# Altium project AirProbe1.PrjPCB
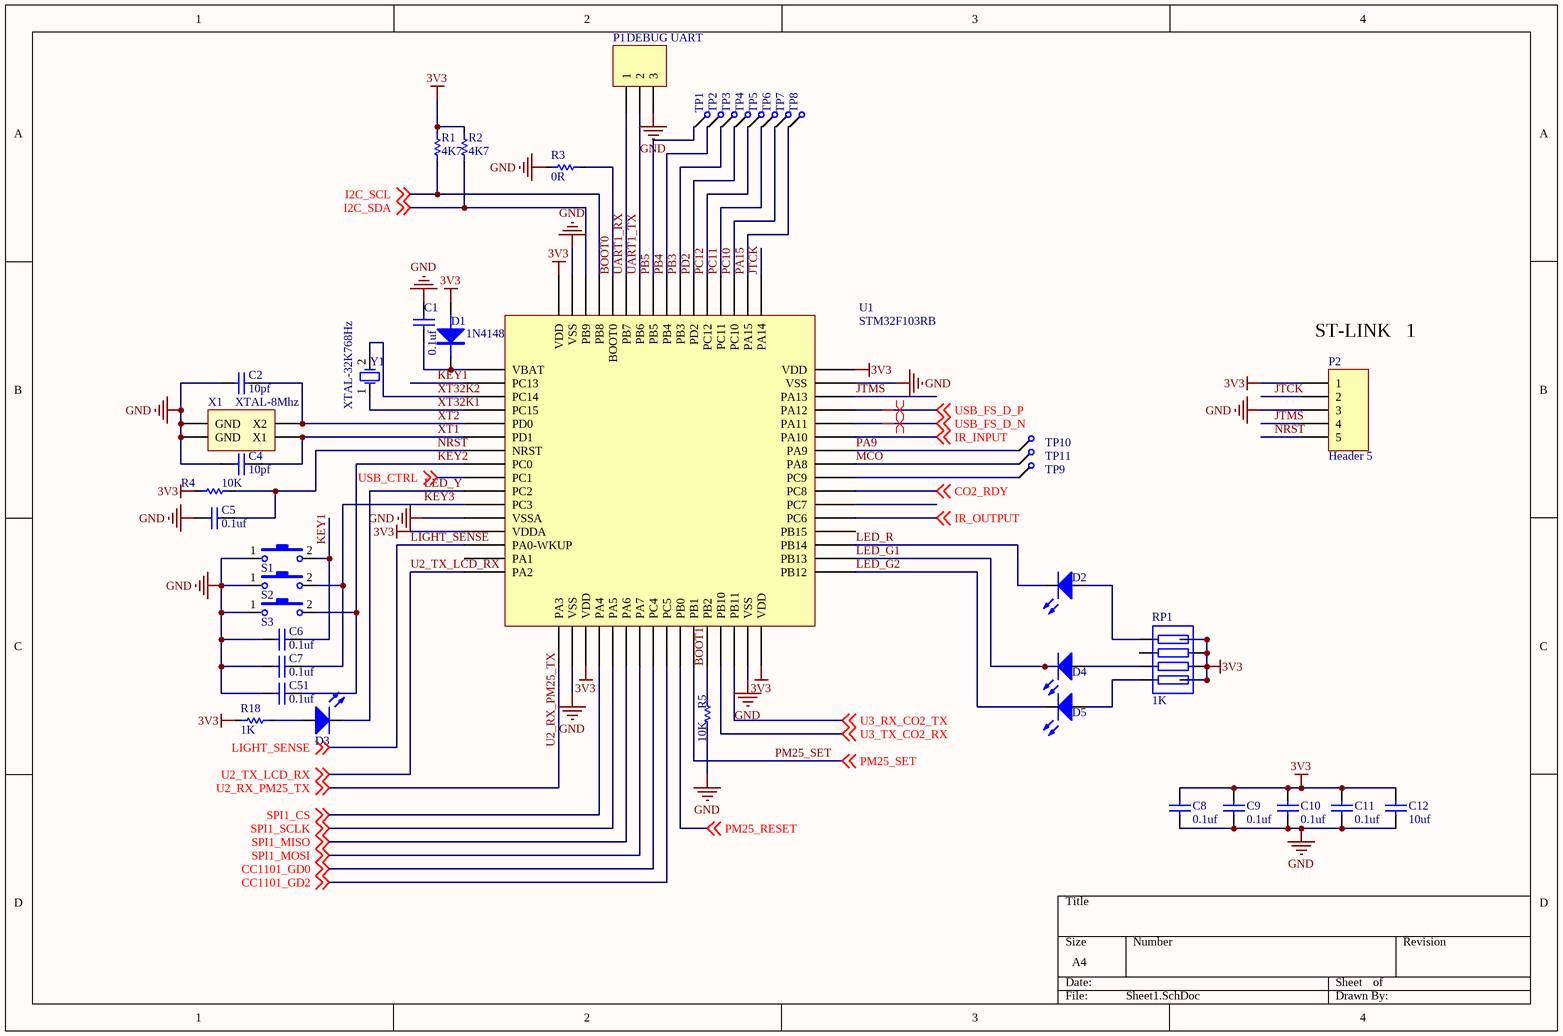
[diagram p0: Sheet1.SchDoc]
4 sheets, 124 parts. Net scope: global (net labels, ports and power ports of the same name join across sheets).
Board file: PCB.PcbDoc
Sheets:
  Sheet1.SchDoc
  Sheet2.SchDoc
  Sheet3.SchDoc
  Sheet4.SchDoc

## Sheet Sheet1.SchDoc
size A4

### Parts
C1  0.1uf  [C0603]
C2  10pf  [C0603]
C4  10pf  [C0603]
C5  0.1uf  [C0603]
C6  0.1uf  [C0603]
C7  0.1uf  [C0603]
C8  0.1uf  [C0603]
C9  0.1uf  [C0603]
C10  0.1uf  [C0603]
C11  0.1uf  [C0603]
C12  10uf  [C1206]
C51  0.1uf  [C0603]
D1  1N4148  [D0805]
D2  红色LED  [LED0603]  (value not drawn)
D3  黄色LED  [LED0603]  (value not drawn)
D4  红色LED  [LED0603]  (value not drawn)
D5  红色LED  [LED0603]  (value not drawn)
P1  DEBUG UART  [HDR1X3]
P2  Header 5  [HDR1X5]
R1  4K7  [R0603]
R2  4K7  [R0603]
R3  0R  [R0603]
R4  10K  [R0603]
R5  10K  [R0603]
R18  1K  [R0603]
RP1  1K  [R_PACK4_SMD]
S1  SW-PB  [SWPB_SMD_90D_48_18_15]  (value not drawn)
S2  SW-PB  [SWPB_SMD_90D_48_18_15]  (value not drawn)
S3  SW-PB  [SW2*1Small]  (value not drawn)
TP1  TestPoint  [TP_0.8]  (value not drawn)
TP2  TestPoint  [TP_0.8]  (value not drawn)
TP3  TestPoint  [TP_0.8]  (value not drawn)
TP4  TestPoint  [TP_0.8]  (value not drawn)
TP5  TestPoint  [TP_0.8]  (value not drawn)
TP6  TestPoint  [TP_0.8]  (value not drawn)
TP7  TestPoint  [TP_0.8]  (value not drawn)
TP8  TestPoint  [TP_0.8]  (value not drawn)
TP9  TestPoint  [TP_0.8]  (value not drawn)
TP10  TestPoint  [TP_0.8]  (value not drawn)
TP11  TestPoint  [TP_0.8]  (value not drawn)
U1  STM32F103RB  [STM32F103RB]
X1  XTAL-8Mhz  [XTAL5032]
Y1  XTAL-32K768Hz  [CRY_S]

### Nets
3V3: C8.2 C9.2 C10.2 C11.2 C12.2 D1.1(A) P2.1 R1.2 R2.2 R4.2 R18.1 RP1.1 RP1.3 RP1.5 RP1.7 U1.13(VDDA) U1.19(VDD) U1.32(VDD) U1.48(VDD) U1.64(VDD)
GND: C1.2 C2.1 C4.2 C5.2 C6.2 C7.2 C8.1 C9.1 C10.1 C11.1 C12.1 C51.1 P1.3 P2.3 R3.1 R5.1 S1.1 S2.1 S3.1 U1.12(VSSA) U1.18(VSS) U1.31(VSS) U1.47(VSS) U1.63(VSS) X1.2(GND) X1.4(GND)
BOOT0: R3.2 U1.60(BOOT0)
BOOT1: R5.2 U1.28(PB2)
CC1101_GD0: U1.24(PC4) ; off-sheet CC1101_GD0
CC1101_GD2: U1.25(PC5) ; off-sheet CC1101_GD2
CO2_RDY: U1.39(PC8) ; off-sheet CO2_RDY
I2C_SCL: R1.1 U1.61(PB8) ; off-sheet I2C_SCL
I2C_SDA: R2.1 U1.62(PB9) ; off-sheet I2C_SDA
IR_INPUT: U1.43(PA10) ; off-sheet IR_INPUT
IR_OUTPUT: U1.37(PC6) ; off-sheet IR_OUTPUT
JTCK: P2.2 U1.49(PA14)
JTMS: P2.4 U1.46(PA13)
KEY1: C6.1 S1.2 U1.2(PC13)
KEY2: C51.2 S3.2 U1.8(PC0)
KEY3: C7.1 S2.2 U1.11(PC3)
LED_G1: D4.2(K) U1.34(PB13)
LED_G2: D5.2(K) U1.33(PB12)
LED_R: D2.2(K) U1.35(PB14)
LED_Y: D3.2(K) U1.10(PC2)
LIGHT_SENSE: U1.14(PA0-WKUP) ; off-sheet LIGHT_SENSE
MCO: TP11.1 U1.41(PA8)
NRST: C5.1 P2.5 R4.1 U1.7(NRST)
PA9: TP10.1 U1.42(PA9)
PA15: TP8.1 U1.50(PA15)
PB3: TP3.1 U1.55(PB3)
PB4: TP2.1 U1.56(PB4)
PB5: TP1.1 U1.57(PB5)
PC10: TP7.1 U1.51(PC10)
PC11: TP6.1 U1.52(PC11)
PC12: TP5.1 U1.53(PC12)
PD2: TP4.1 U1.54(PD2)
PM25_RESET: U1.26(PB0) ; off-sheet PM25_RESET
PM25_SET: U1.27(PB1) ; off-sheet PM25_SET
SPI1_CS: U1.20(PA4) ; off-sheet SPI1_CS
SPI1_MISO: U1.22(PA6) ; off-sheet SPI1_MISO
SPI1_MOSI: U1.23(PA7) ; off-sheet SPI1_MOSI
SPI1_SCLK: U1.21(PA5) ; off-sheet SPI1_SCLK
U2_RX_PM25_TX: U1.17(PA3) ; off-sheet U2_RX_PM25_TX
U2_TX_LCD_RX: U1.16(PA2) ; off-sheet U2_TX_LCD_RX
U3_RX_CO2_TX: U1.30(PB11) ; off-sheet U3_RX_CO2_TX
U3_TX_CO2_RX: U1.29(PB10) ; off-sheet U3_TX_CO2_RX
UART1_RX: P1.1 U1.59(PB7)
UART1_TX: P1.2 U1.58(PB6)
USB_CTRL: U1.9(PC1) ; off-sheet USB_CTRL
USB_FS_D_N: U1.44(PA11) ; off-sheet USB_FS_D_N
USB_FS_D_P: U1.45(PA12) ; off-sheet USB_FS_D_P
XT1: C4.1 U1.6(PD1) X1.1(X1)
XT2: C2.2 U1.5(PD0) X1.3(X2)
XT32K1: U1.4(PC15) Y1.1(OSC1)
XT32K2: U1.3(PC14) Y1.2(OSC2)
NetC1_1: C1.1 D1.2(K) U1.1(VBAT)
NetD2_1: D2.1(A) RP1.8
NetD3_1: D3.1(A) R18.2
NetD4_1: D4.1(A) RP1.4
NetD5_1: D5.1(A) RP1.2
NetTP9_1: TP9.1 U1.40(PC9)

Not connected (* = marked no-connect by the designer): RP1 6; U1 15(PA1) 36(PB15) 38(PC7)

### Layout directives
differential pair: USB_FS_D_N, USB_FS_D_P

### Notes on the sheet
- (near P2) ST-LINK   1

### Library data of the parts
C1 C5-C12 C51 = Cap: Capacitor; Option: 25V  X7R
  C1 C5-C11 C51: Value: 0.1uf
  C12: Value: 10uf
C2 C4 = Cap: Capacitor; Published: 8-Jun-2000; LatestRevisionDate: 17-Jul-2002; LatestRevisionNote: Re-released for DXP Platform.; PackageReference: RAD-0.3; Publisher: Altium Limited; Value: 10pf
D1 = DIODE: Value: 1N4148
D2-D5 = LED: Typical INFRARED GaAs LED; Published: 8-Jun-2000; LatestRevisionDate: 08-Jul-2005; LatestRevisionNote: Mech Layer 1 removed.; PackageReference: LED-0; Publisher: Altium Limited
  D2 D4 D5: Color: 红色LED
  D3: Color: 黄色LED
P1 = Header 3: Header, 3-Pin; LatestRevisionDate: 17-Jul-2002; LatestRevisionNote: Re-released for DXP Platform.; Publisher: Altium Limited
P2 = Header 5: Header, 5-Pin; LatestRevisionDate: 17-Jul-2002; LatestRevisionNote: Re-released for DXP Platform.; Publisher: Altium Limited
R1-R5 R18 = Res: Published: 8-Jun-2000; LatestRevisionDate: 17-Jul-2002; LatestRevisionNote: Re-released for DXP Platform.; PackageReference: AXIAL-0.3; Publisher: Altium Limited
  R1 R2: Value: 4K7
  R3: Value: 0R
  R4 R5: Value: 10K
  R18: Value: 1K
RP1 = RESPACK4: Value: 1K
S1-S3 = SW-PB: Switch; Published: 24-Mar-1999; LatestRevisionDate: 17-Jul-2002; LatestRevisionNote: Re-released for DXP Platform.; PackageReference: SPST-2; Publisher: Altium Limited
TP1-TP11 = TestPoint: 一个测试点
X1 = XTALSMT
Y1 = XTAL: Crystal Oscillator 32K; Published: 8-Jun-2000; LatestRevisionDate: 17-Jul-2002; LatestRevisionNote: Re-released for DXP Platform.; PackageReference: R38; Publisher: Altium Limited

## Sheet Sheet2.SchDoc
size A4
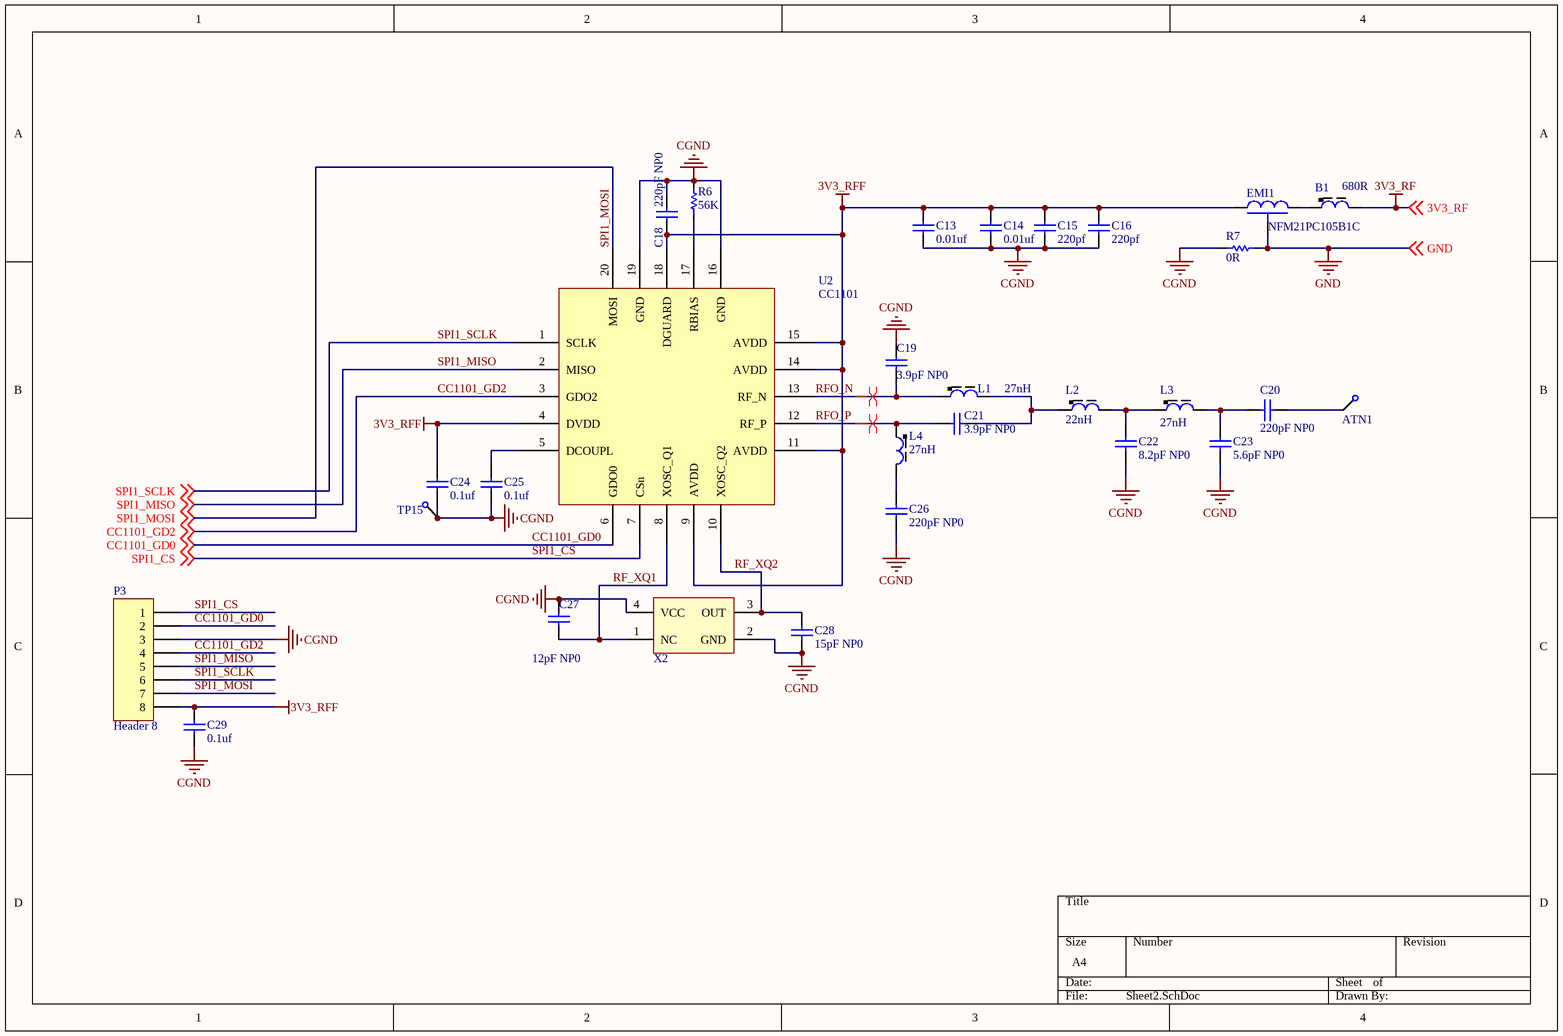
[diagram p1: Sheet2.SchDoc]

### Parts
ATN1  TestPoint  [TP]  (value not drawn)
B1  680R  [L0603]
C13  0.01uf  [C0603]
C14  0.01uf  [C0603]
C15  220pf  [C0603]
C16  220pf  [C0603]
C18  220pF NP0  [C0603]
C19  3.9pF NP0  [C0603]
C20  220pF NP0  [C0603]
C21  3.9pF NP0  [C0603]
C22  8.2pF NP0  [C0603]
C23  5.6pF NP0  [C0603]
C24  0.1uf  [C0603]
C25  0.1uf  [C0603]
C26  220pF NP0  [C0603]
C27  12pF NP0  [C0603]
C28  15pF NP0  [C0603]
C29  0.1uf  [C0603]
EMI1  NFM21PC105B1C  [NFM21PC]
L1  27nH  [L0603]
L2  22nH  [L0603]
L3  27nH  [L0603]
L4  27nH  [L0603]
P3  Header 8  [CC1101]
R6  56K  [R0603]
R7  0R  [R0603]
TP15  TestPoint  [TP_0.8]  (value not drawn)
U2  CC1101  [QFN50P400X400X80_HS-21N]
X2  XTAL4  [XTAL3225]  (value not drawn)

### Nets
3V3_RF: B1.2 ; off-sheet 3V3_RF
3V3_RFF: C13.2 C14.2 C15.2 C16.2 C18.1 C24.2 C29.2 EMI1.1 P3.8 U2.4(DVDD) U2.9(AVDD) U2.11(AVDD) U2.14(AVDD) U2.15(AVDD) U2.18(DGUARD)
CGND: C13.1 C14.1 C15.1 C16.1 C18.2 C19.2 C22.1 C23.1 C24.1 C25.1 C26.1 C27.2 C28.1 C29.1 P3.3 R6.2 R7.1 TP15.1 U2.16(GND) U2.19(GND) X2.2(GND) X2.4(VCC)
GND: EMI1.2 R7.2 ; off-sheet GND
CC1101_GD0: P3.2 U2.6(GDO0) ; off-sheet CC1101_GD0
CC1101_GD2: P3.4 U2.3(GDO2) ; off-sheet CC1101_GD2
RF_XQ1: C27.1 U2.8(XOSC_Q1) X2.1(NC)
RF_XQ2: C28.2 U2.10(XOSC_Q2) X2.3(OUT)
RFO_N: C19.1 L1.1 U2.13(RF_N)
RFO_P: C21.2 L4.1 U2.12(RF_P)
SPI1_CS: P3.1 U2.7(CSn) ; off-sheet SPI1_CS
SPI1_MISO: P3.5 U2.2(MISO) ; off-sheet SPI1_MISO
SPI1_MOSI: P3.7 U2.20(MOSI) ; off-sheet SPI1_MOSI
SPI1_SCLK: P3.6 U2.1(SCLK) ; off-sheet SPI1_SCLK
NetATN1_1: ATN1.1 C20.1
NetB1_1: B1.1 EMI1.3
NetC20_2: C20.2 C23.2 L3.2
NetC21_1: C21.1 L1.2 L2.1
NetC22_2: C22.2 L2.2 L3.1
NetC25_2: C25.2 U2.5(DCOUPL)
NetC26_2: C26.2 L4.2
NetR6_1: R6.1 U2.17(RBIAS)

### Layout directives
differential pair: RFO_N, RFO_P

### Library data of the parts
ATN1 TP15 = TestPoint: 一个测试点
B1 L2 = L
  B1: Value: 680R
  L2: Value: 22nH
C13-C16 C18-C29 = Cap: Capacitor; Option: 25V  X7R
  C13 C14: Value: 0.01uf
  C15 C16: Value: 220pf
  C18 C20 C26: Value: 220pF NP0
  C19 C21: Value: 3.9pF NP0
  C22: Value: 8.2pF NP0
  C23: Value: 5.6pF NP0
  C24 C25 C29: Value: 0.1uf
  C27: Value: 12pF NP0
  C28: Value: 15pF NP0
L1 L3 L4 = L: LQG15HS27NJ02D; Value: 27nH
P3 = Header 8: Header, 8-Pin; LatestRevisionDate: 17-Jul-2002; LatestRevisionNote: Re-released for DXP Platform.; Publisher: Altium Limited
R6 R7 = Res: Published: 8-Jun-2000; LatestRevisionDate: 17-Jul-2002; LatestRevisionNote: Re-released for DXP Platform.; PackageReference: AXIAL-0.3; Publisher: Altium Limited
  R6: Value: 56K
  R7: Value: 0R

## Sheet Sheet3.SchDoc
size A4
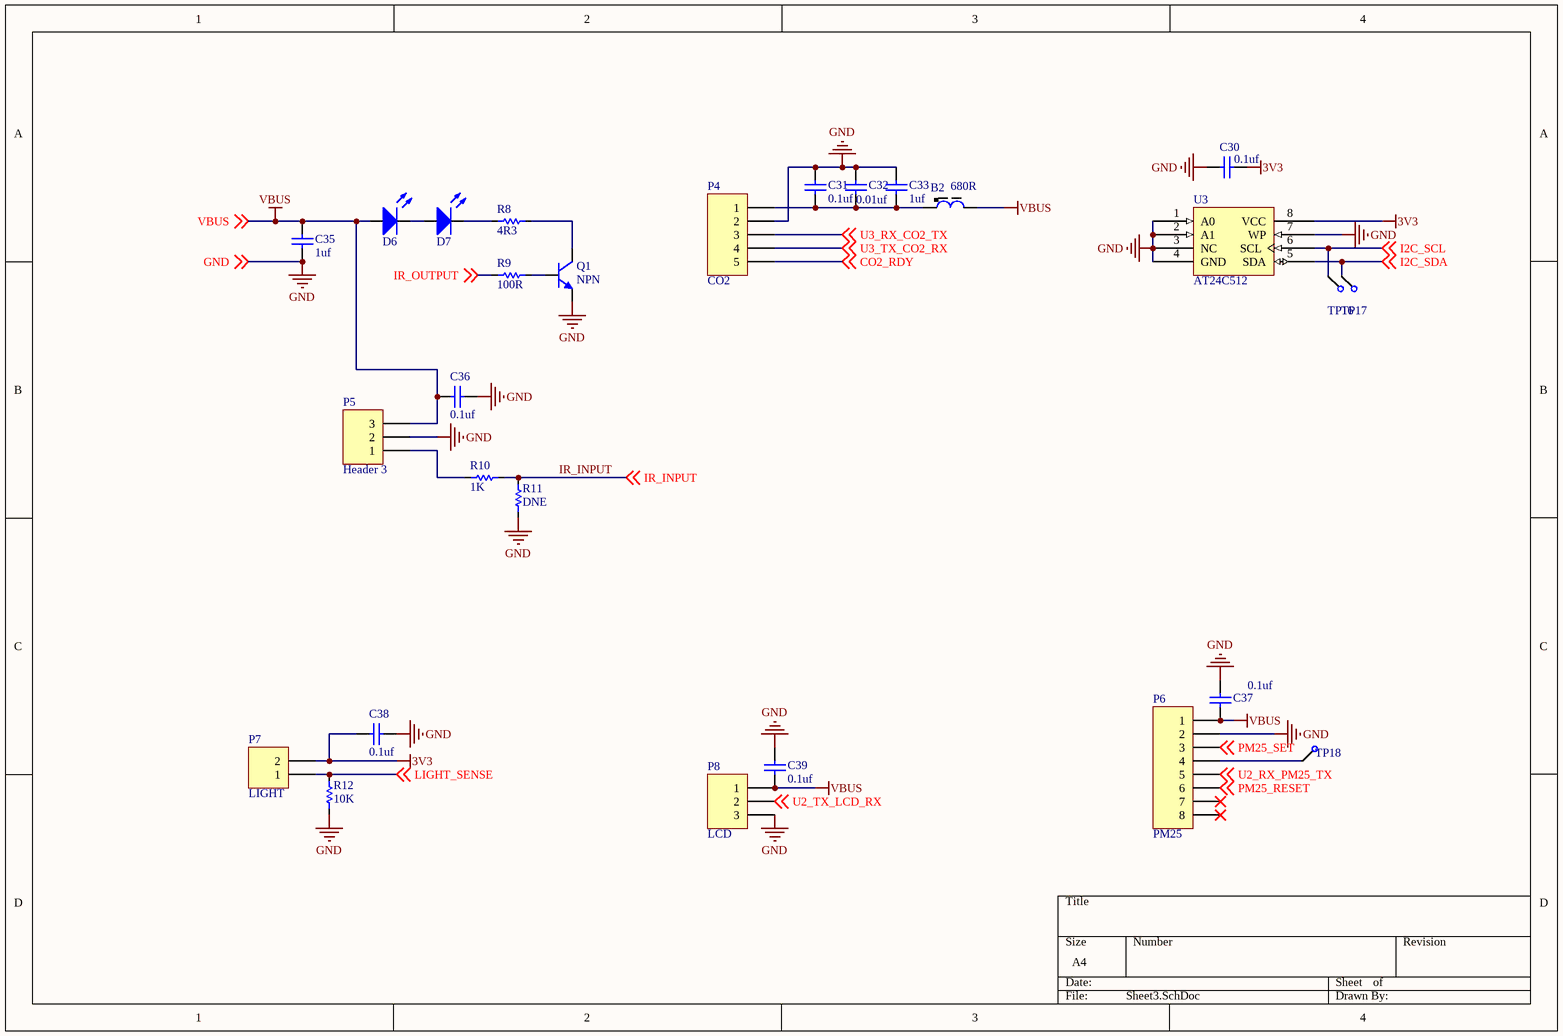
[diagram p2: Sheet3.SchDoc]

### Parts
B2  680R  [L0603]
C30  0.1uf  [C0603]
C31  0.1uf  [C0603]
C32  0.01uf  [C0603]
C33  1uf  [C0603]
C35  1uf  [C0603]
C36  0.1uf  [C0603]
C37  0.1uf  [C0603]
C38  0.1uf  [C0603]
C39  0.1uf  [C0603]
D6  LED-R  [LED_S]  (value not drawn)
D7  LED-R  [LED_S]  (value not drawn)
P4  CO2  [HDR1X5]
P5  Header 3  [HDR1X3]
P6  PM25  [1.25T-8P]
P7  LIGHT  [HDR1X2]
P8  LCD  [HDR1X3]
Q1  NPN  [SOT23_BJT]
R8  4R3  [R0805]
R9  100R  [R0603]
R10  1K  [R0603]
R11  DNE  [R0603]
R12  10K  [R0603]
TP16  TestPoint  [TP_0.8]  (value not drawn)
TP17  TestPoint  [TP_0.8]  (value not drawn)
TP18  TestPoint  [TP_0.8]  (value not drawn)
U3  AT24C512  [AT24C02]

### Nets
3V3: C30.2 C38.2 P7.2 U3.8(VCC)
GND: C30.1 C31.2 C32.2 C33.2 C35.1 C36.1 C37.2 C38.1 C39.2 P4.2 P5.2 P6.2 P8.3 Q1.1(E) R11.1 R12.1 U3.1(A0) U3.2(A1) U3.3(NC) U3.4(GND) U3.7(WP) ; off-sheet GND
VBUS: B2.2 C35.2 C36.2 C37.1 C39.1 D6.1(A) P5.3 P6.1 P8.1 ; off-sheet VBUS
CO2_RDY: P4.5 ; off-sheet CO2_RDY
I2C_SCL: TP16.1 U3.6(SCL) ; off-sheet I2C_SCL
I2C_SDA: TP17.1 U3.5(SDA) ; off-sheet I2C_SDA
IR_INPUT: R10.2 R11.2 ; off-sheet IR_INPUT
IR_OUTPUT: R9.1 ; off-sheet IR_OUTPUT
LIGHT_SENSE: P7.1 R12.2 ; off-sheet LIGHT_SENSE
PM25_RESET: P6.6 ; off-sheet PM25_RESET
PM25_SET: P6.3 ; off-sheet PM25_SET
U2_RX_PM25_TX: P6.5 ; off-sheet U2_RX_PM25_TX
U2_TX_LCD_RX: P8.2 ; off-sheet U2_TX_LCD_RX
U3_RX_CO2_TX: P4.3 ; off-sheet U3_RX_CO2_TX
U3_TX_CO2_RX: P4.4 ; off-sheet U3_TX_CO2_RX
NetB2_1: B2.1 C31.1 C32.1 C33.1 P4.1
NetD6_2: D6.2(K) D7.1(A)
NetD7_2: D7.2(K) R8.2
NetP5_1: P5.1 R10.1
NetP6_4: P6.4 TP18.1
NetQ1_2: Q1.2(B) R9.2
NetQ1_3: Q1.3(C) R8.1

Not connected (* = marked no-connect by the designer): P6 7* 8*

### Library data of the parts
B2 = L: Value: 680R
C30-C33 C35-C39 = Cap: Capacitor; Option: 25V  X7R
  C30 C31 C36-C39: Value: 0.1uf
  C32: Value: 0.01uf
  C33 C35: Value: 1uf
D6 D7 = LED: Typical INFRARED GaAs LED; Published: 8-Jun-2000; LatestRevisionDate: 08-Jul-2005; LatestRevisionNote: Mech Layer 1 removed.; PackageReference: LED-0; Publisher: Altium Limited; Color: LED-R
P4 = Header 5: Header, 5-Pin; LatestRevisionDate: 17-Jul-2002; LatestRevisionNote: Re-released for DXP Platform.; Publisher: Altium Limited
P5 P8 = Header 3: Header, 3-Pin; LatestRevisionDate: 17-Jul-2002; LatestRevisionNote: Re-released for DXP Platform.; Publisher: Altium Limited
P6 = Header 8: Header, 8-Pin; LatestRevisionDate: 17-Jul-2002; LatestRevisionNote: Re-released for DXP Platform.; Publisher: Altium Limited
P7 = Header 2: Header, 2-Pin; LatestRevisionDate: 17-Jul-2002; LatestRevisionNote: Re-released for DXP Platform.; Publisher: Altium Limited
Q1 = NPN: NPN Bipolar Transistor; Published: 8-Jun-2000; LatestRevisionDate: 17-Jul-2002; LatestRevisionNote: Re-released for DXP Platform.; PackageReference: TO-226; Publisher: Altium Limited; Code_JEDEC: TO-226-AA
R8-R12 = Res: Published: 8-Jun-2000; LatestRevisionDate: 17-Jul-2002; LatestRevisionNote: Re-released for DXP Platform.; PackageReference: AXIAL-0.3; Publisher: Altium Limited
  R8: Value: 4R3
  R9: Value: 100R
  R10: Value: 1K
  R11: Value: DNE
  R12: Value: 10K
TP16-TP18 = TestPoint: 一个测试点
U3 = AT24C512: 2-wire Serial  EEPROM  512K (65,536 x 8)

## Sheet Sheet4.SchDoc
size A4
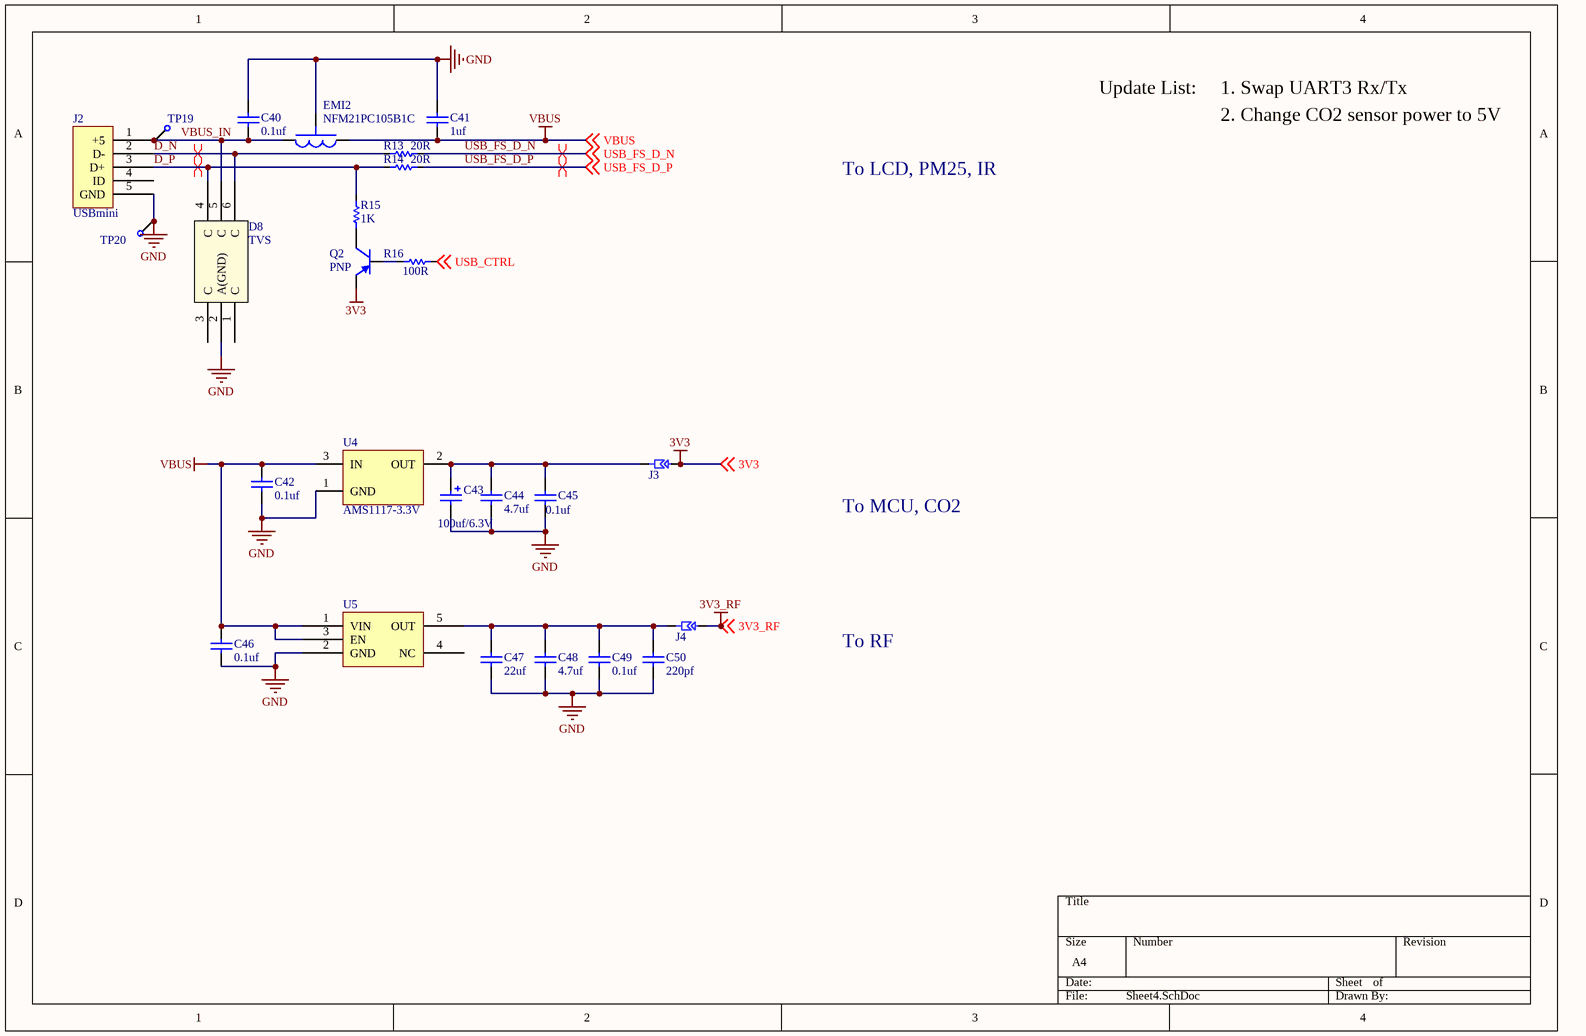
[diagram p3: Sheet4.SchDoc]

### Parts
C40  0.1uf  [C0603]
C41  1uf  [C0603]
C42  0.1uf  [C0603]
C43  value 100uf/6.3V  [C_B型]  (hidden comment: 25V)
C44  4.7uf  [C0805]
C45  0.1uf  [C0603]
C46  0.1uf  [C0603]
C47  22uf  [C1206]
C48  4.7uf  [C0603]
C49  0.1uf  [C0603]
C50  220pf  [C0603]
D8  TVS  [USBLC6-2]
EMI2  NFM21PC105B1C  [NFM21PC]
J2  USBmini  [USB_MICRO_B]
J3  JUMPER  [Jsmall]  (value not drawn)
J4  JUMPER  [Jsmall]  (value not drawn)
Q2  PNP  [SOT23_BJT]
R13  20R  [R0603]
R14  20R  [R0603]
R15  1K  [R0603]
R16  100R  [R0603]
TP19  TestPoint  [TP_0.8]  (value not drawn)
TP20  TestPoint  [TP_0.8]  (value not drawn)
U4  AMS1117-3.3V  [SOT223]
U5  ADP151  [ADP151]  (value not drawn)

### Nets
3V3: J3.2 Q2.1(E) ; off-sheet 3V3
3V3_RF: J4.2 ; off-sheet 3V3_RF
GND: C40.2 C41.2 C42.1 C43.2 C44.1 C45.1 C46.1 C47.1 C48.1 C49.1 C50.1 D8.2(A(GND)) EMI2.2 J2.5(GND) TP20.1 U4.1(GND) U5.2(GND)
VBUS: C41.1 C42.2 C46.2 EMI2.1 U4.3(IN) U5.1(VIN) U5.3(EN) ; off-sheet VBUS
D_N: D8.6(C) J2.2(D-) R13.1
D_P: D8.4(C) J2.3(D+) R14.1 R15.2
USB_CTRL: R16.2 ; off-sheet USB_CTRL
USB_FS_D_N: R13.2 ; off-sheet USB_FS_D_N
USB_FS_D_P: R14.2 ; off-sheet USB_FS_D_P
VBUS_IN: C40.1 D8.5(C) EMI2.3 J2.1(+5) TP19.1
NetC43_1: C43.1 C44.2 C45.2 J3.1 U4.2(OUT)
NetC47_2: C47.2 C48.2 C49.2 C50.2 J4.1 U5.5(OUT)
NetQ2_2: Q2.2(B) R16.1
NetQ2_3: Q2.3(C) R15.1

Not connected (* = marked no-connect by the designer): D8 1(C) 3(C); J2 4(ID); U5 4(NC)

### Layout directives
differential pair: D_N, D_P, USB_FS_D_N, USB_FS_D_P

### Notes on the sheet
- Update List:
- 1. Swap UART3 Rx/Tx
- To LCD, PM25, IR
- 2. Change CO2 sensor power to 5V
- To MCU, CO2
- To RF

### Library data of the parts
C40-C42 C44-C50 = Cap: Capacitor; Option: 25V  X7R
  C40 C42 C45 C46 C49: Value: 0.1uf
  C41: Value: 1uf
  C44 C48: Value: 4.7uf
  C47: Value: 22uf
  C50: Value: 220pf
C43 = Cap+: Polarized Capacitor (Radial); Voltage: 25V
D8 = USBLC6-2
J2 = USB_mini
J3 J4 = J
Q2 = PNP: PNP Bipolar Transistor; Published: 8-Jun-2000; LatestRevisionDate: 17-Jul-2002; LatestRevisionNote: Re-released for DXP Platform.; PackageReference: SOT-23B; Publisher: Altium Limited; Code_JEDEC: SOT-23
R13-R16 = Res: Published: 8-Jun-2000; LatestRevisionDate: 17-Jul-2002; LatestRevisionNote: Re-released for DXP Platform.; PackageReference: AXIAL-0.3; Publisher: Altium Limited
  R13 R14: Value: 20R
  R15: Value: 1K
  R16: Value: 100R
TP19 TP20 = TestPoint: 一个测试点
U4 = 1117: Value: AMS1117-3.3V

## Nets that join several sheets
3V3: Sheet1 (20 pins), Sheet3 (C30.2 C38.2 P7.2 U3.8), Sheet4 (J3.2 Q2.1)
3V3_RF: Sheet2 (B1.2), Sheet4 (J4.2)
GND: Sheet1 (26 pins), Sheet2 (EMI1.2 R7.2), Sheet3 (21 pins), Sheet4 (17 pins)
VBUS: Sheet3 (9 pins), Sheet4 (7 pins)
CC1101_GD0: Sheet1 (U1.24), Sheet2 (P3.2 U2.6)
CC1101_GD2: Sheet1 (U1.25), Sheet2 (P3.4 U2.3)
CO2_RDY: Sheet1 (U1.39), Sheet3 (P4.5)
I2C_SCL: Sheet1 (R1.1 U1.61), Sheet3 (TP16.1 U3.6)
I2C_SDA: Sheet1 (R2.1 U1.62), Sheet3 (TP17.1 U3.5)
IR_INPUT: Sheet1 (U1.43), Sheet3 (R10.2 R11.2)
IR_OUTPUT: Sheet1 (U1.37), Sheet3 (R9.1)
LIGHT_SENSE: Sheet1 (U1.14), Sheet3 (P7.1 R12.2)
PM25_RESET: Sheet1 (U1.26), Sheet3 (P6.6)
PM25_SET: Sheet1 (U1.27), Sheet3 (P6.3)
SPI1_CS: Sheet1 (U1.20), Sheet2 (P3.1 U2.7)
SPI1_MISO: Sheet1 (U1.22), Sheet2 (P3.5 U2.2)
SPI1_MOSI: Sheet1 (U1.23), Sheet2 (P3.7 U2.20)
SPI1_SCLK: Sheet1 (U1.21), Sheet2 (P3.6 U2.1)
U2_RX_PM25_TX: Sheet1 (U1.17), Sheet3 (P6.5)
U2_TX_LCD_RX: Sheet1 (U1.16), Sheet3 (P8.2)
U3_RX_CO2_TX: Sheet1 (U1.30), Sheet3 (P4.3)
U3_TX_CO2_RX: Sheet1 (U1.29), Sheet3 (P4.4)
USB_CTRL: Sheet1 (U1.9), Sheet4 (R16.2)
USB_FS_D_N: Sheet1 (U1.44), Sheet4 (R13.2)
USB_FS_D_P: Sheet1 (U1.45), Sheet4 (R14.2)